# EAGLE design lead acid charger (EAGLE 6.5.0)
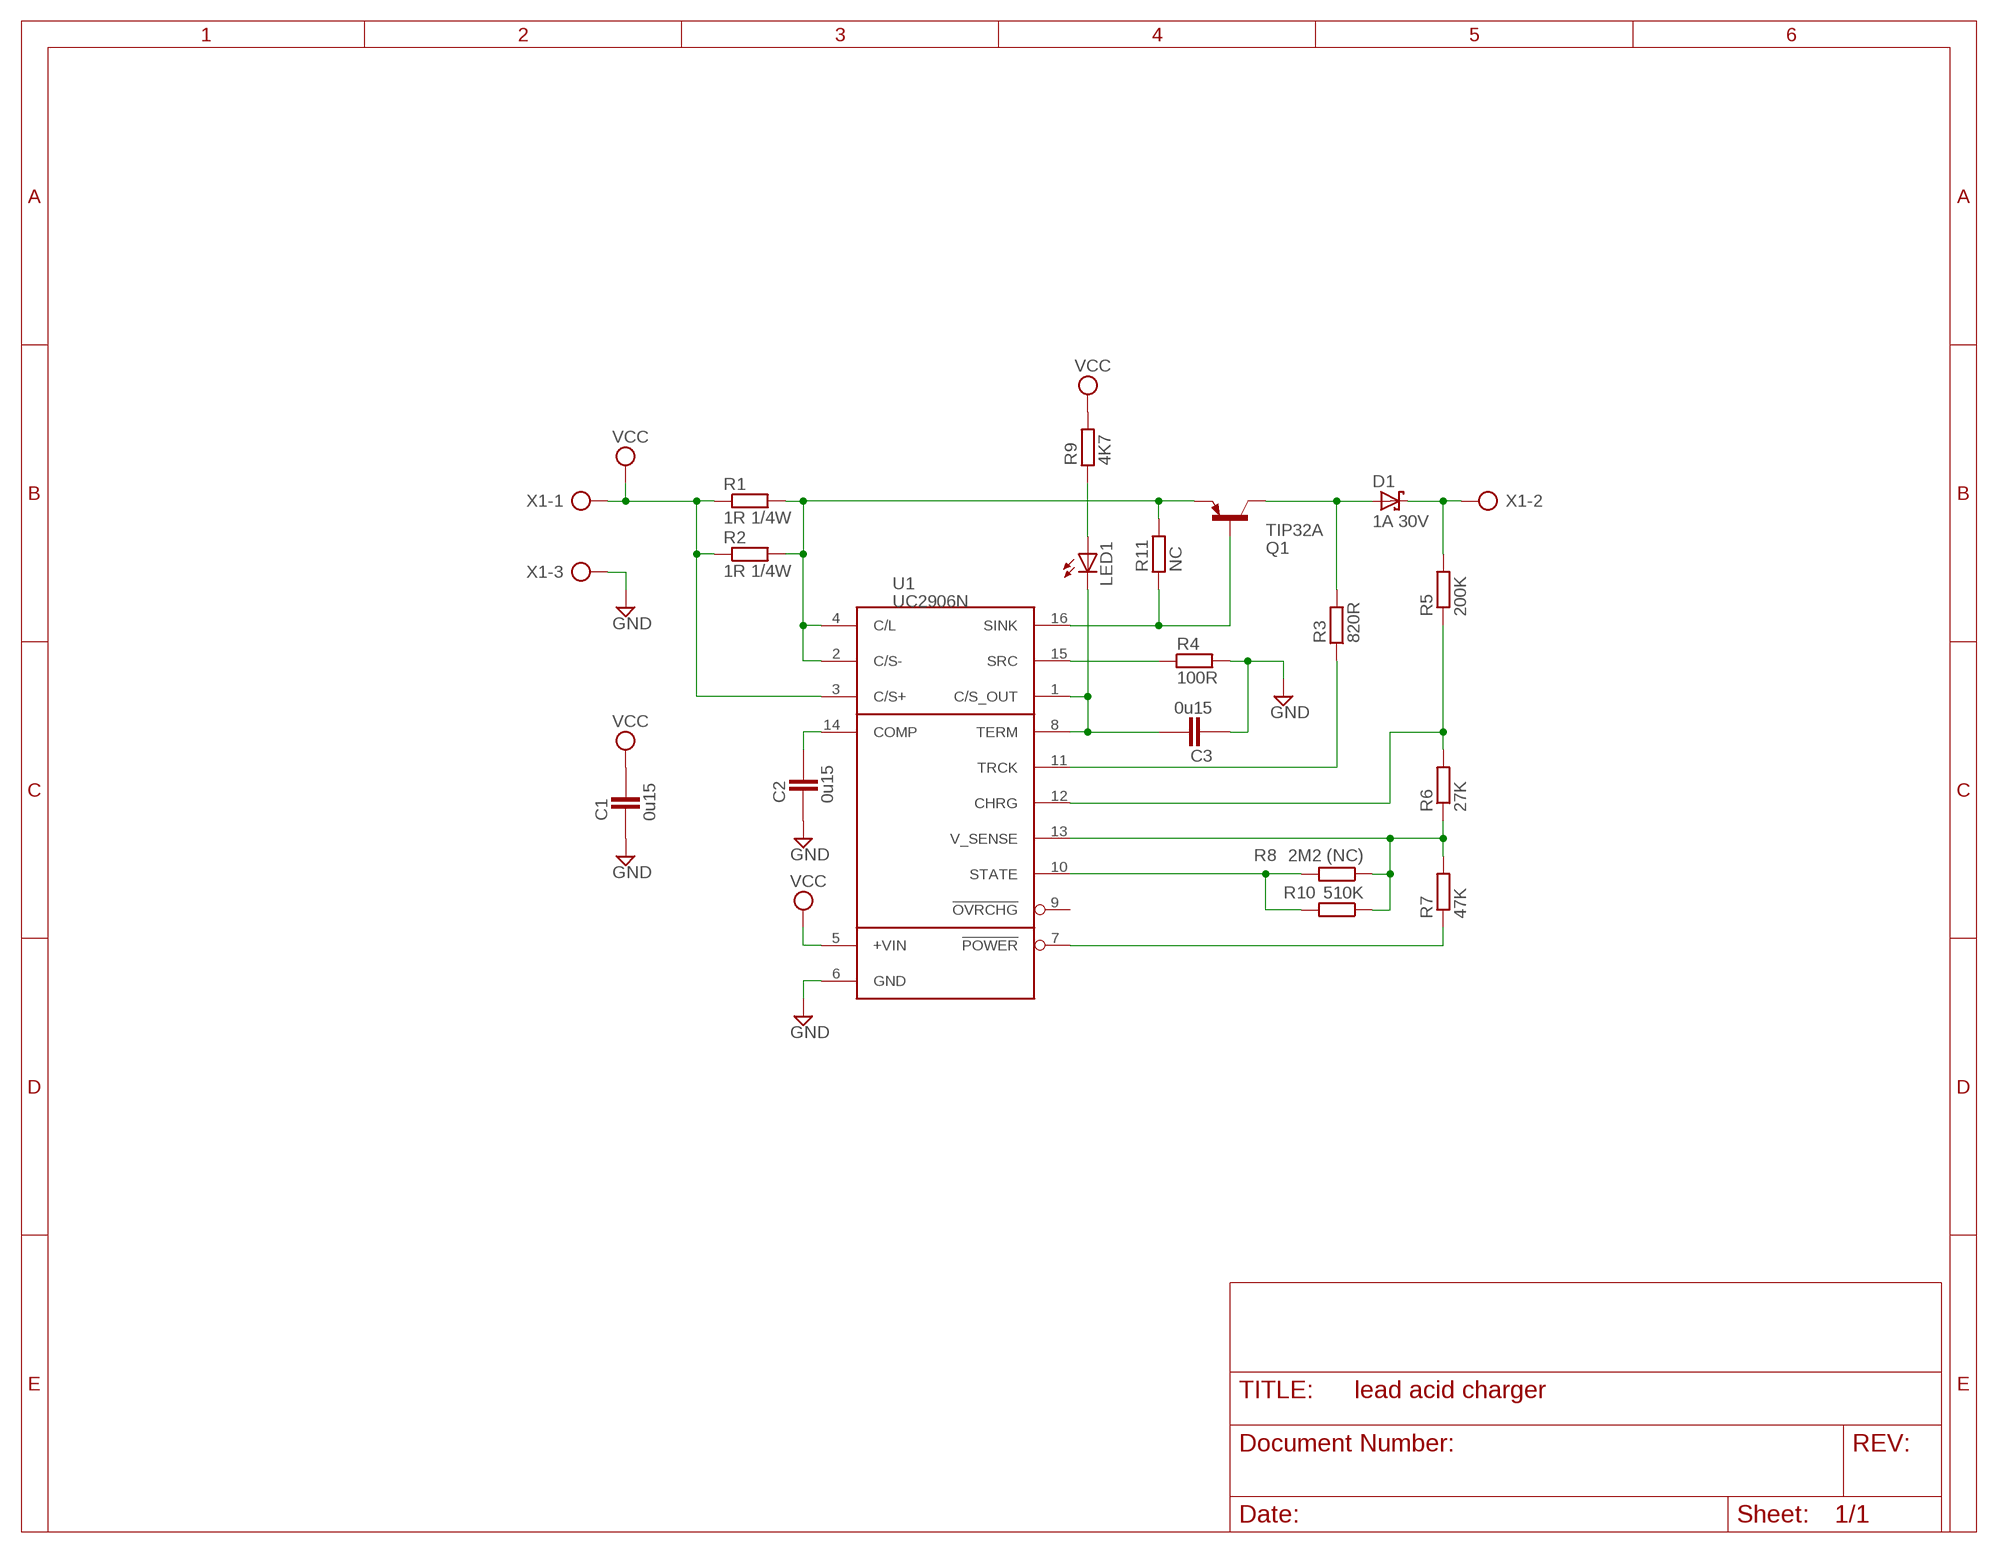
[diagram p0: schematic, sheet 1]

## Parts
C1  0u15  CAPACITOR_0805N  [CAP2012X70N]
C2  0u15  CAPACITOR_0805N  [CAP2012X70N]
C3  0u15  CAPACITOR_0805N  [CAP2012X70N]
D1  1A 30V  SCHOTTKY_SMB  [DIOM5436X265N]
LED1  LED3MM  [LED3MM]
Q1  TIP32A  TIP30  [TO220]
R1  1R 1/4W  R-EU_0207/10  [0207/10]
R2  1R 1/4W  R-EU_0207/10  [0207/10]
R3  820R  RESISTOR_1206  [RESC3115X70N]
R4  100R  RESISTOR_0805  [RESC2012X70N]
R5  200K  R-EU_0207/10  [0207/10]
R6  27K  R-EU_0207/10  [0207/10]
R7  47K  R-EU_0207/10  [0207/10]
R8  2M2 (NC)  R-EU_0207/10  [0207/10]
R9  4K7  RESISTOR_0805  [RESC2012X70N]
R10  510K  R-EU_0207/10  [0207/10]
R11  NC  RESISTOR_0603  [RESC1608X55N]
U1  UC2906N  [DIL16]
X1  AK500/3  [AK500-3]

## Nets
GND: C1.1 C2.1 C3.1 R4.2 U1.6(GND) X1.3
N$1: C2.2 U1.14(COMP)
N$2: D1.K R5.2 X1.2
N$3: Q1.3(E) R1.2 R2.2 R11.2 U1.2(C/S-) U1.4(C/L)
N$4: C3.2 LED1.K(C) U1.1(C/S_OUT) U1.8(TERM)
N$5: R7.1 U1.7(!POWER)
N$6: D1.A Q1.2(C) R3.2
N$7: Q1.1(B) R11.1 U1.16(SINK)
N$8: R3.1 U1.11(TRCK)
N$9: R4.1 U1.15(SRC)
N$10: R6.1 R7.2 R8.1 R10.1 U1.13(V_SENSE)
N$11: R5.1 R6.2 U1.12(CHRG)
N$12: R8.2 R10.2 U1.10(STATE)
N$14: LED1.A R9.1
VCC: C1.2 R1.1 R2.1 R9.2 U1.3(C/S+) U1.5(+VIN) X1.1
Unconnected: U1.9(!OVRCHG)

## Library data of the parts
C1-C3 = ipc-7351-capacitor:CAPACITOR_
D1 = ipc-7351-diode:SCHOTTKY_
LED1 = SparkFun:LED: LEDs Standard schematic elements and footprints for 5mm, 3mm, 1206, and 0603 sized LEDs. 5mm - Spark Fun Electronics SKU : COM-00529 (and others)
Q1 = transistor-pnp:TIP30: PNP Transistor
R1 R2 R5-R8 R10 = rcl:R-EU_: RESISTOR, European symbol
R3 R4 R9 R11 = ipc-7351-resistor:RESISTOR_
U1 = Misc Power:UC2906
X1 = con-ptr500:AK500/3: CONNECTOR

## Board
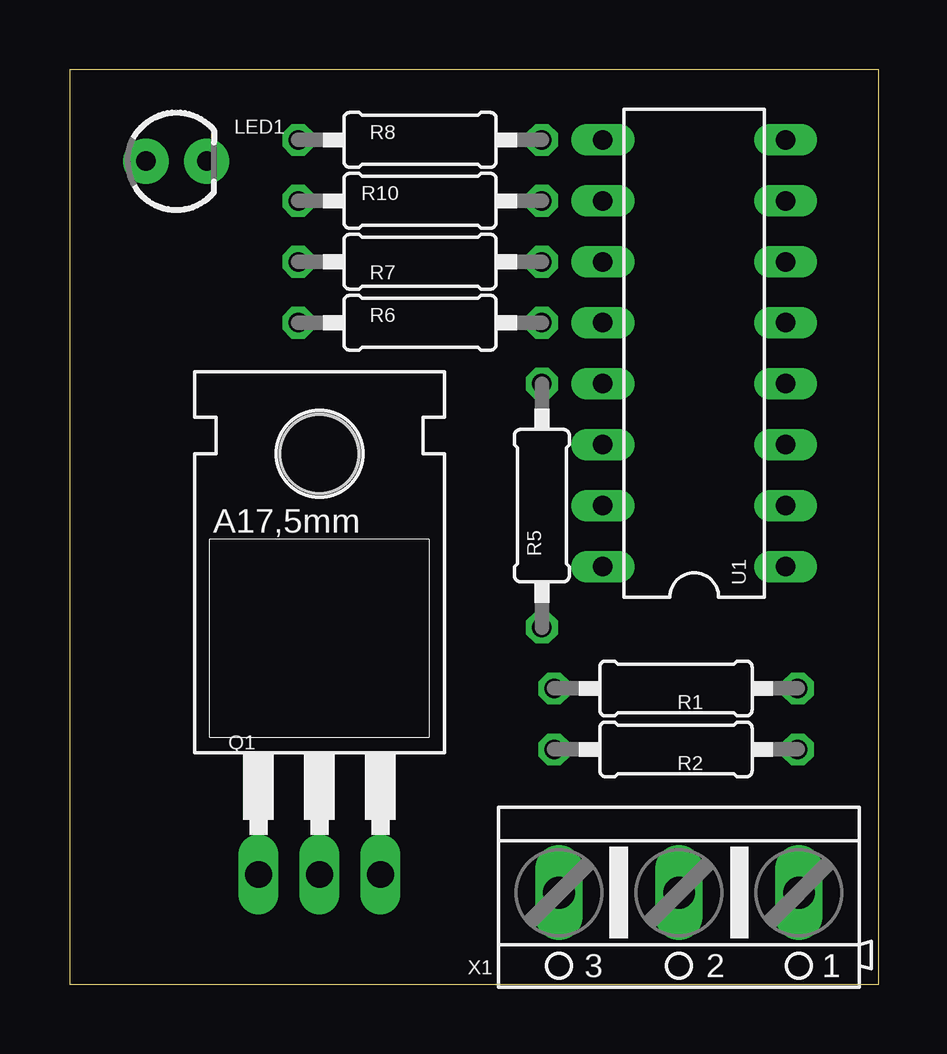
[diagram p1: board, top side]
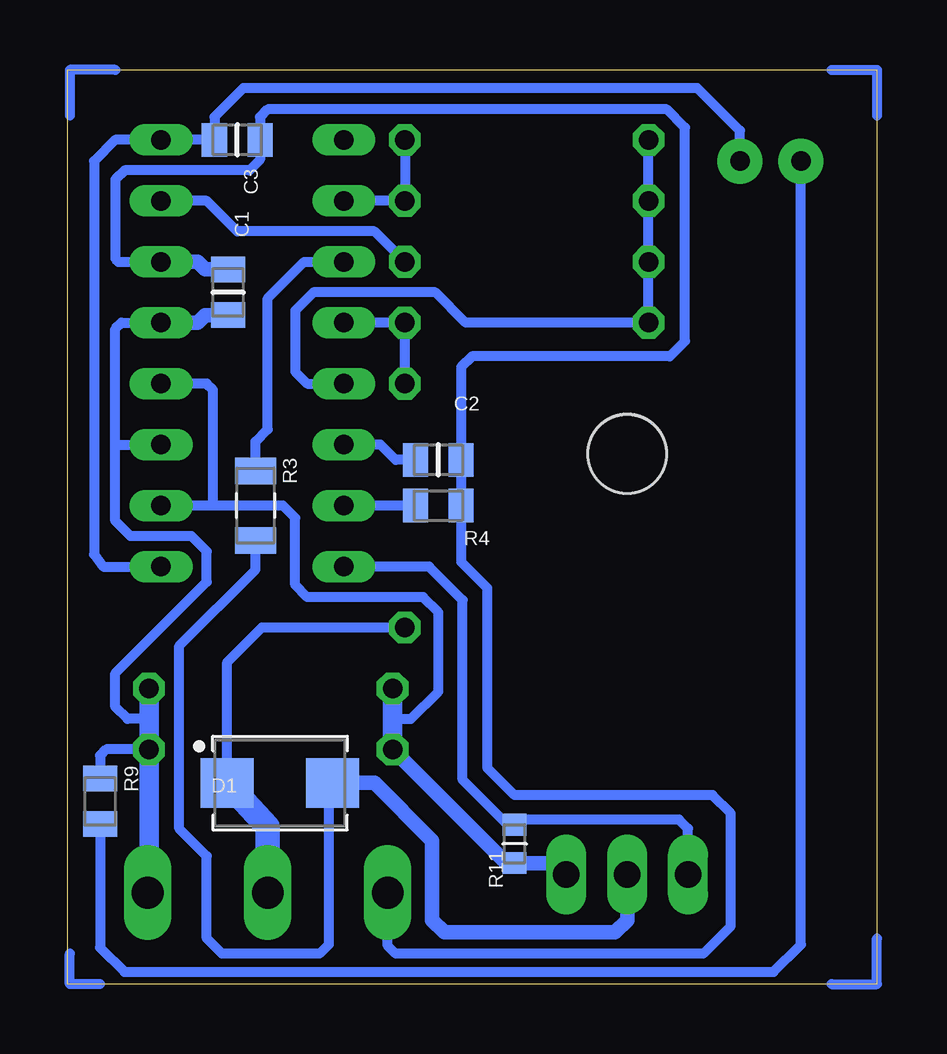
[diagram p2: board, bottom side, seen from below]

Size 33.73 x 38.1 mm. Coordinates in mm from the lower left corner, seen from the top.
Outline: 0,0 33.73,0 33.73,38.1 0,38.1 0,0
Copper layers (1*16): Top 0.035mm / dielectric 1.5mm / Bottom 0.035mm
Design rules "default": minimum track width 10mil, minimum drill 24mil, track to track 8mil, track to pad 8mil, pad to pad 8mil, via to via 8mil, smd to smd 8mil, copper to edge 40mil, drill to drill 8mil, minimum pad ring 10mil, minimum via ring 8mil, stop-mask expansion 4mil, vias tented up to drill 0mil, thermal gap 10mil
Holes 3.25 mm at 10.41,22.1

### Footprints (pad centres in the part's own frame; a part is rotated, then mirrored left to right if it is on the bottom)
CAP2012X70N = smd 1.05 x 1.4: 1 -0.95,0; 2 0.95,0
DIOM5436X265N = smd 2.2 x 2.05: A 2.2,0; K -2.2,0
LED3MM = drill 0.813 pad 1.88: A -1.27,0; K 1.27,0
TO220 = drill 1.118 long: 1 -2.54,0; 2 0,0; 3 2.54,0 | hole 3.302: 0,17.526
0207/10 = drill 0.813 octagon: 1 -5.08,0; 2 5.08,0
RESC3115X70N = smd 1.1 x 1.7: 1 -1.45,0; 2 1.45,0
RESC2012X70N = smd 1.05 x 1.4: 1 -0.95,0; 2 0.95,0
RESC1608X55N = smd 0.9 x 1: 1 -0.8,0; 2 0.8,0
DIL16 = drill 0.813 long: 1 -8.89,-3.81; 2 -6.35,-3.81; 3 -3.81,-3.81; 4 -1.27,-3.81; 5 1.27,-3.81; 6 3.81,-3.81; 7 6.35,-3.81; 8 8.89,-3.81; 9 8.89,3.81; 10 6.35,3.81; 11 3.81,3.81; 12 1.27,3.81; 13 -1.27,3.81; 14 -3.81,3.81; 15 -6.35,3.81; 16 -8.89,3.81
AK500-3 = drill 1.321 long: 1 -5.004,0; 2 0,0; 3 5.004,0

### Placement (x,y rotation side)
C1  27.05,28.83 270 bottom
C2  18.29,21.84 180 bottom
C3  26.67,35.18 180 bottom
D1  24.89,8.38 0 bottom
LED1  4.45,34.29 0 top
Q1  10.41,4.57 0 top
R1  25.27,12.32 180 top
R2  25.27,9.78 180 top
R3  25.91,19.94 270 bottom
R4  18.29,19.94 0 bottom
R5  19.68,19.94 270 top
R6  14.61,27.56 0 top
R7  14.61,30.1 180 top
R8  14.61,35.18 0 top
R9  32.38,7.62 90 bottom
R10  14.61,32.64 0 top
R11  15.11,5.84 270 bottom
U1  26.04,26.29 90 top
X1  25.4,3.81 180 top

### Tracks (layer width: path | path; a pad name or v marks a point on that pad's centre or on a via)
GND
  Bottom 0.406: U1.6 31.62,30.1 31.75,30.23 31.75,33.53 31.37,33.91 26.16,33.91 25.72,34.35 C3.1 25.72,36.13 25.4,36.45 8.76,36.45 8,35.69 8,26.8 8.64,26.16 16.89,26.16 17.34,25.71 C2.1 R4.2 17.34,17.59 16.26,16.51 16.26,9.02 15.11,7.87 6.86,7.87 6.1,7.11 6.1,2.41 7.24,1.27 20.07,1.27 20.4,1.6 X1.3
  Bottom 0.61: C1.1 28,29.78 28.32,30.1 U1.6
N$1
  Bottom 0.406: C2.2 20.07,21.84 20.7,22.48 U1.14
N$2
  Bottom 0.406: R5.2 25.65,14.86 27.09,13.42 D1.K
  Bottom 1.016: X1.2 25.4,6.56 D1.K
N$3
  Bottom 0.406: U1.4 27.94,25.02 27.69,24.77 27.69,19.94 | 27.69,19.94 U1.2 | 27.69,19.94 24.77,19.94 24.26,19.43 24.26,16.64 23.75,16.13 18.92,16.13 18.29,15.49 18.29,12.19 19.43,11.05 20.19,11.05
  Bottom 0.61: R2.2 15.46,5.04 R11.2 13.42,5.04 Q1.3
  Bottom 0.813: R2.2 20.19,11.05 R1.2
N$4
  Bottom 0.406: U1.1 32.26,17.4 32.64,17.91 32.64,34.29 31.75,35.18 U1.8 C3.2 27.62,36.13 26.42,37.34 7.49,37.34 5.71,35.56 LED1.K
N$5
  Bottom 0.406: U1.7 27.94,32.64 26.67,31.37 20.95,31.37 R7.1
N$6
  Bottom 0.406: R3.2 25.91,17.27 29.08,14.1 29.08,6.48 27.94,5.33 27.94,1.91 27.3,1.27 23.24,1.27 22.86,1.65 22.86,8.21 D1.A
  Bottom 0.61: Q1.2 10.41,2.67 10.92,2.16 18.03,2.16 18.54,2.67 18.54,5.97 20.95,8.38 D1.A
N$7
  Bottom 0.406: Q1.1 7.87,6.48 8.26,6.86 14.9,6.86 R11.1 15.4,6.64 17.27,8.51 17.27,16 18.67,17.4 U1.16
N$8
  Bottom 0.406: R3.1 25.91,22.61 25.4,23.11 25.4,28.57 23.88,30.1 U1.11
N$9
  Bottom 0.406: R4.1 U1.15
N$10
  Bottom 0.406: R8.1 R10.1 R7.2 R6.1 17.14,27.56 18.41,28.83 23.5,28.83 24.26,28.07 24.26,25.53 23.75,25.02 U1.13
N$11
  Bottom 0.406: U1.12 R6.2 R5.1
N$12
  Bottom 0.406: U1.10 R10.2 R8.2
N$13
  Bottom 0.406: 1.91,38.1 0,38.1 0,36.2
N$14
  Bottom 0.406: R9.1 32.38,1.52 31.37,0.51 4.32,0.51 3.17,1.65 LED1.A
N$15
  Bottom 0.406: 31.75,38.1 33.66,38.1 33.66,36.2
N$16
  Bottom 0.406: 0,1.91 0,0 1.91,0
N$17
  Bottom 0.406: 32.38,0 33.66,0 33.66,1.27
VCC
  Bottom 0.406: U1.5 31.5,27.56 31.75,27.3 31.75,22.48 | 31.75,22.48 U1.3 | 31.75,22.48 31.75,19.3 31.11,18.67 28.57,18.67 27.94,18.03 27.94,16.76 31.75,12.95 31.75,11.56 31.24,11.05 30.35,11.05 | X1.1 30.35,3.76 | R2.1 32.13,9.78 32.38,9.53 R9.2
  Bottom 0.61: C1.2 28,27.88 28.32,27.56 U1.5
  Bottom 0.813: R1.1 30.35,11.05 R2.1 30.35,3.86 X1.1
(copper drawn outside any net)
  shapes: Bottom circle x1